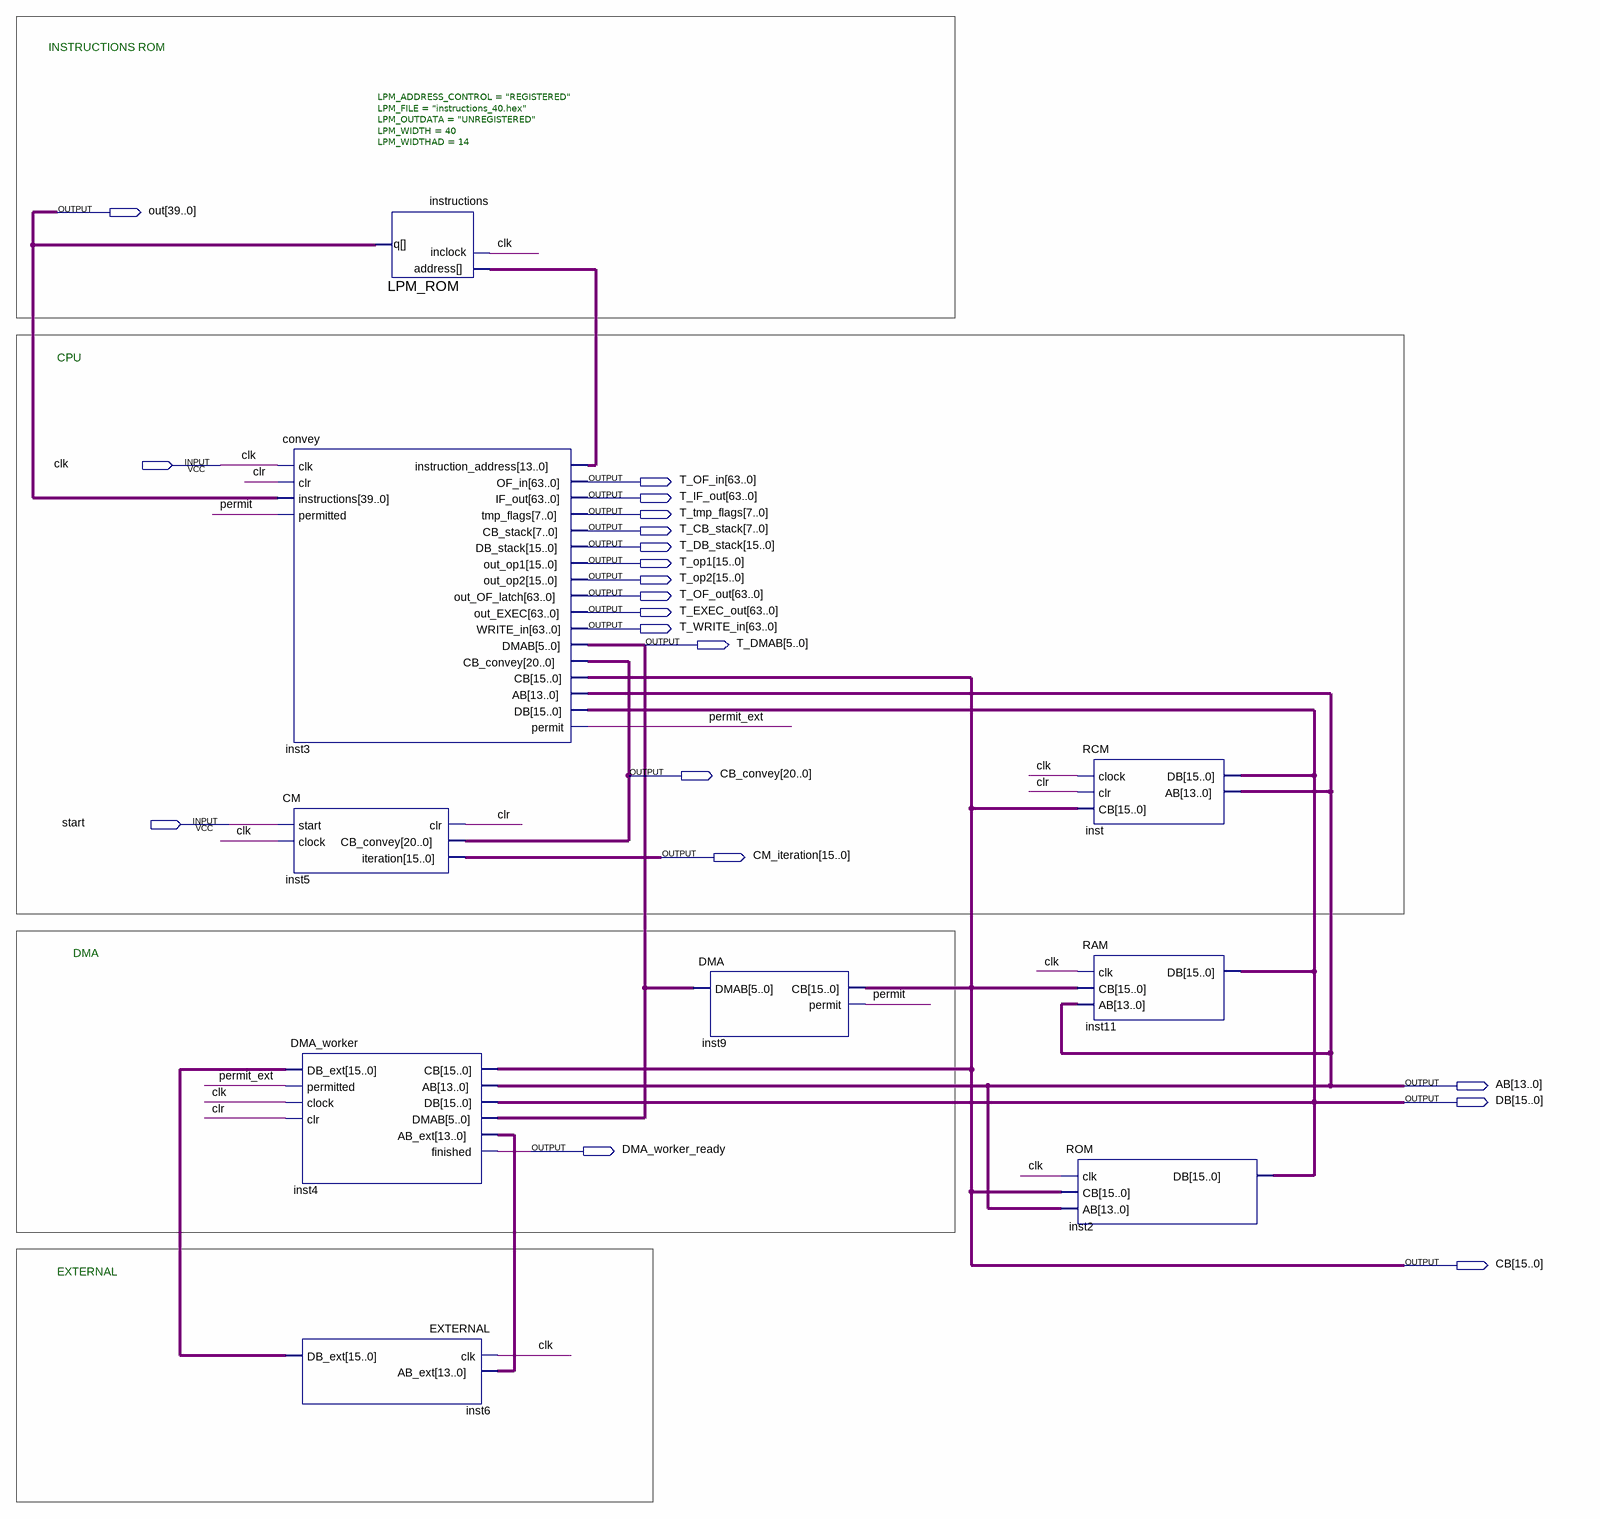
[diagram p0: schematic sheet]
// Quartus schematic full.bdf as structural Verilog: 9 symbols, 20 pins
module full (
  input  clk,
  input  start,
  output [39:0] out,
  output [63:0] T_OF_in,
  output [63:0] T_IF_out,
  output [7:0] T_tmp_flags,
  output [7:0] T_CB_stack,
  output [15:0] T_DB_stack,
  output [15:0] T_op1,
  output [15:0] T_op2,
  output [63:0] T_OF_out,
  output [63:0] T_EXEC_out,
  output [63:0] T_WRITE_in,
  output [5:0] T_DMAB,
  output [20:0] CB_convey,
  output [15:0] CM_iteration,
  output [13:0] AB,
  output [15:0] DB,
  output DMA_worker_ready,
  output [15:0] CB
);

  wire clr, permit, permit_ext;
  wire [13:0] inst3_instruction_address, inst4_ab_ext;
  wire [15:0] inst6_db_ext;

  convey inst3 (
    .clk(clk), .clr(clr), .instructions(out), .permitted(permit),
    .instruction_address(inst3_instruction_address), .OF_in(T_OF_in), .IF_out(T_IF_out),
    .tmp_flags(T_tmp_flags), .CB_stack(T_CB_stack), .DB_stack(T_DB_stack), .out_op1(T_op1), .out_op2(T_op2),
    .out_OF_latch(T_OF_out), .out_EXEC(T_EXEC_out), .WRITE_in(T_WRITE_in), .permit(permit_ext),
    .DMAB(T_DMAB), .CB_convey(CB_convey), .CB(CB), .AB(AB), .DB(DB));
  CM inst5 (.start(start), .clock(clk), .clr(clr), .iteration(CM_iteration), .CB_convey(CB_convey));
  DMA_worker inst4 (
    .DB_ext(inst6_db_ext), .permitted(permit_ext), .clock(clk), .clr(clr), .AB_ext(inst4_ab_ext),
    .finished(DMA_worker_ready), .CB(CB), .AB(AB), .DB(DB), .DMAB(T_DMAB));
  EXTERNAL inst6 (.clk(clk), .AB_ext(inst4_ab_ext), .DB_ext(inst6_db_ext));
  LPM_ROM #(.LPM_ADDRESS_CONTROL("REGISTERED"), .LPM_FILE("instructions_40.hex"), .LPM_OUTDATA("UNREGISTERED"), .LPM_WIDTH(40), .LPM_WIDTHAD(14)) instructions (
    .address(inst3_instruction_address), .inclock(clk), .q(out));
  DMA inst9 (.DMAB(T_DMAB), .permit(permit), .CB(CB));
  RCM inst (.clock(clk), .clr(clr), .CB(CB), .DB(DB), .AB(AB));
  RAM inst11 (.clk(clk), .CB(CB), .AB(AB), .DB(DB));
  ROM inst2 (.clk(clk), .CB(CB), .AB(AB), .DB(DB));

  // Notes on the sheet:
  //   INSTRUCTIONS ROM
  //   CPU
  //   DMA
  //   EXTERNAL
endmodule
